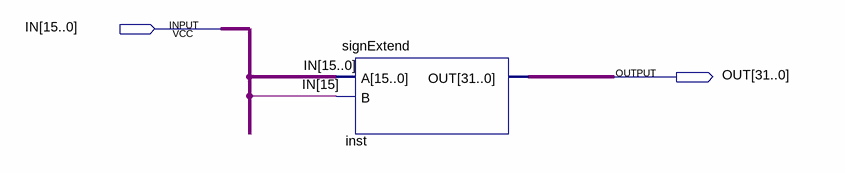
[diagram p0: schematic sheet]
// Quartus schematic extend.bdf as structural Verilog: 1 symbols, 2 pins
module extend (
  input  [15:0] IN,
  output [31:0] OUT
);

  signExtend inst (.A(IN), .B(IN[15]), .OUT(OUT));
endmodule
